# Altium schematic sheet Control_Logic.SchDoc
size A3; SheetNumber: 9; SheetTotal: 9
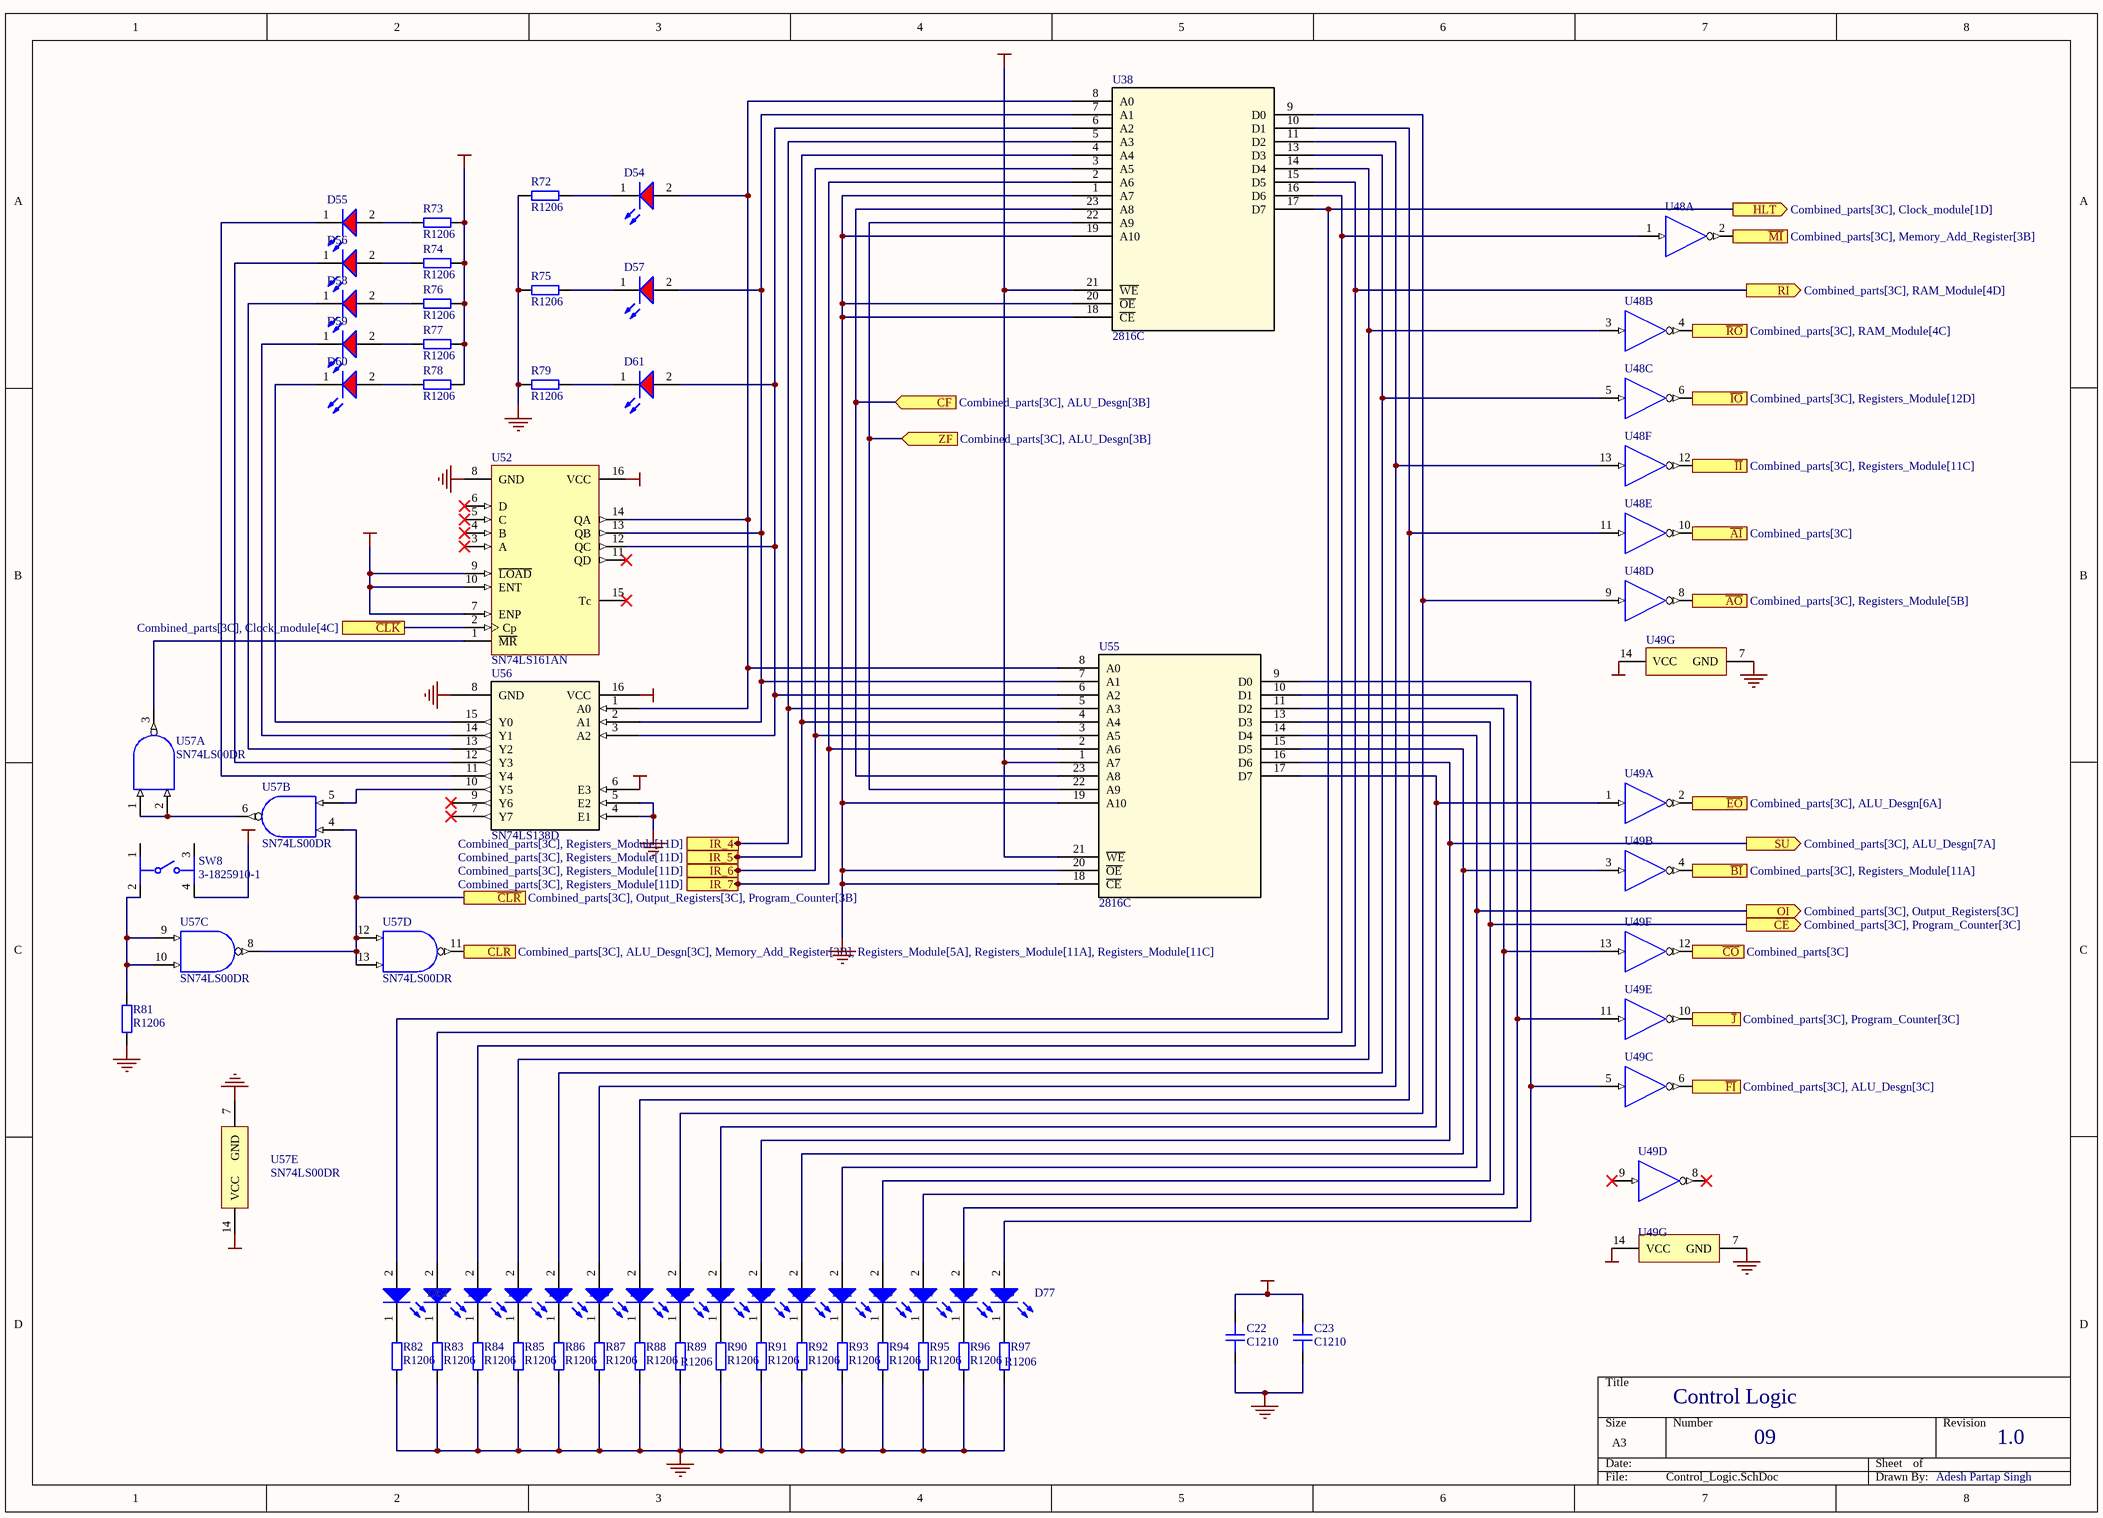
[diagram p0: Control_Logic.SchDoc]

## Parts
(Parts that share a designator on the sheet are numbered #1, #2 ... from top to bottom, then left to right.)
C22  C1210  [CAP_1210]
C23  C1210  [CAP_1210]
D54  151053RS03000  [WL-TMRW_D5.8H11.7]  (value not drawn)
D55  151053RS03000  [WL-TMRW_D5.8H11.7]  (value not drawn)
D56  151053RS03000  [WL-TMRW_D5.8H11.7]  (value not drawn)
D57  151053RS03000  [WL-TMRW_D5.8H11.7]  (value not drawn)
D58  151053RS03000  [WL-TMRW_D5.8H11.7]  (value not drawn)
D59  151053RS03000  [WL-TMRW_D5.8H11.7]  (value not drawn)
D60  151053RS03000  [WL-TMRW_D5.8H11.7]  (value not drawn)
D61  151053RS03000  [WL-TMRW_D5.8H11.7]  (value not drawn)
D62  151053BS04500  [WL-TMRW_D5.8H11.7]  (value not drawn)
D63  151053BS04500  [WL-TMRW_D5.8H11.7]  (value not drawn)
D64  151053BS04500  [WL-TMRW_D5.8H11.7]  (value not drawn)
D65  151053BS04500  [WL-TMRW_D5.8H11.7]  (value not drawn)
D66  151053BS04500  [WL-TMRW_D5.8H11.7]  (value not drawn)
D67  151053BS04500  [WL-TMRW_D5.8H11.7]  (value not drawn)
D68  151053BS04500  [WL-TMRW_D5.8H11.7]  (value not drawn)
D69  151053BS04500  [WL-TMRW_D5.8H11.7]  (value not drawn)
D70  151053BS04500  [WL-TMRW_D5.8H11.7]  (value not drawn)
D71  151053BS04500  [WL-TMRW_D5.8H11.7]  (value not drawn)
D72  151053BS04500  [WL-TMRW_D5.8H11.7]  (value not drawn)
D73  151053BS04500  [WL-TMRW_D5.8H11.7]  (value not drawn)
D74  151053BS04500  [WL-TMRW_D5.8H11.7]  (value not drawn)
D75  151053BS04500  [WL-TMRW_D5.8H11.7]  (value not drawn)
D76  151053BS04500  [WL-TMRW_D5.8H11.7]  (value not drawn)
D77  151053BS04500  [WL-TMRW_D5.8H11.7]  (value not drawn)
R72  R1206  [RES_1206]
R73  R1206  [RES_1206]
R74  R1206  [RES_1206]
R75  R1206  [RES_1206]
R76  R1206  [RES_1206]
R77  R1206  [RES_1206]
R78  R1206  [RES_1206]
R79  R1206  [RES_1206]
R81  R1206  [RES_1206]
R82  R1206  [RES_1206]
R83  R1206  [RES_1206]
R84  R1206  [RES_1206]
R85  R1206  [RES_1206]
R86  R1206  [RES_1206]
R87  R1206  [RES_1206]
R88  R1206  [RES_1206]
R89  R1206  [RES_1206]
R90  R1206  [RES_1206]
R91  R1206  [RES_1206]
R92  R1206  [RES_1206]
R93  R1206  [RES_1206]
R94  R1206  [RES_1206]
R95  R1206  [RES_1206]
R96  R1206  [RES_1206]
R97  R1206  [RES_1206]
SW8  3-1825910-1  [FP-3-1825910-1-MFG]
U38  2816C  [28P6_ATM]
U48  SN74LS04NSR  [NS0014A_M]  (value not drawn)  (parts A,B,C,D,E,F of 7)
U49#1  SN74LS04NSR  [NS0014A_M]  (value not drawn)  (parts A,B,C,D,E,F,G of 7)
U49#2  SN74LS04NSR  [NS0014A_M]  (value not drawn)  (part G of 7)
U52  SN74LS161AN  [N0016A]
U55  2816C  [28P6_ATM]
U56  SN74LS138D  [D16]
U57  SN74LS00DR  [D0014A_L]  (parts A,B,C,D,E of 5)

## Ports
CE (out, see Combined_parts[3C], Program_Counter[3C]), CF (in, see Combined_parts[3C], ALU_Desgn[3B]), CLR (see Combined_parts[3C], ALU_Desgn[3C], Memory_Add_Register[3B], Registers_Module[5A], Registers_Module[11A], Registers_Module[11C]), HLT (out, see Combined_parts[3C], Clock_module[1D]), IR_4 (in, see Combined_parts[3C], Registers_Module[11D]), IR_5 (in, see Combined_parts[3C], Registers_Module[11D]), IR_6 (in, see Combined_parts[3C], Registers_Module[11D]), IR_7 (in, see Combined_parts[3C], Registers_Module[11D]), OI (out, see Combined_parts[3C], Output_Registers[3C]), RI (out, see Combined_parts[3C], RAM_Module[4D]), SU (out, see Combined_parts[3C], ALU_Desgn[7A]), ZF (in, see Combined_parts[3C], ALU_Desgn[3B]), ~{AI} (out, see Combined_parts[3C]), ~{AO} (out, see Combined_parts[3C], Registers_Module[5B]), ~{BI} (out, see Combined_parts[3C], Registers_Module[11A]), ~{CLK} (see Combined_parts[3C], Clock_module[4C]), ~{CLR} (see Combined_parts[3C], Output_Registers[3C], Program_Counter[3B]), ~{CO} (out, see Combined_parts[3C]), ~{EO} (out, see Combined_parts[3C], ALU_Desgn[6A]), ~{FI} (out, see Combined_parts[3C], ALU_Desgn[3C]), ~{II} (out, see Combined_parts[3C], Registers_Module[11C]), ~{IO} (out, see Combined_parts[3C], Registers_Module[12D]), ~{J} (out, see Combined_parts[3C], Program_Counter[3C]), ~{MI} (out, see Combined_parts[3C], Memory_Add_Register[3B]), ~{RO} (out, see Combined_parts[3C], RAM_Module[4C])

## Nets
GND: C22.1 C23.1 R72.1 R75.1 R79.1 R81.1 R82.1 R83.1 R84.1 R85.1 R86.1 R87.1 R88.1 R89.1 R90.1 R91.1 R92.1 R93.1 R94.1 R95.1 R96.1 R97.1 U38.1(A7) U38.18(~{CE}) U38.19(A10) U38.20(~{OE}) U49#1.7(GND) U49#2.7(GND) U52.8(GND) U55.18(~{CE}) U55.19(A10) U55.20(~{OE}) U56.4(E1) U56.5(E2) U56.8(GND) U57.7(GND)
VCC: C22.2 C23.2 R73.2 R74.2 R76.2 R77.2 R78.2 SW8.4 U38.21(~{WE}) U49#1.14(VCC) U49#2.14(VCC) U52.7(ENP) U52.9(~{LOAD}) U52.10(ENT) U52.16(VCC) U55.1(A7) U55.21(~{WE}) U56.6(E3) U56.16(VCC) U57.14(VCC)
~{AI}: U48.10(~{5Y}) ; port ~{AI}
~{AO}: U48.8(~{4Y}) ; port ~{AO}
~{BI}: U49#1.4(~{2Y}) ; port ~{BI}
~{CLK}: U52.2(Cp) ; port ~{CLK}
~{CLR}: U57.4(2A) U57.8(3Y) U57.12(4A) U57.13(4B) ; port ~{CLR}
~{CO}: U49#1.12(~{6Y}) ; port ~{CO}
CE: D74.2(A) U55.13(D3) ; port CE
CF: U38.23(A8) U55.23(A8) ; port CF
CLR: U57.11(4Y) ; port CLR
~{EO}: U49#1.2(~{1Y}) ; port ~{EO}
~{FI}: U49#1.6(~{3Y}) ; port ~{FI}
HLT: D62.2(A) U38.17(D7) ; port HLT
~{II}: U48.12(~{6Y}) ; port ~{II}
~{IO}: U48.6(~{3Y}) ; port ~{IO}
IR_4: U38.5(A3) U55.5(A3) ; port IR_4
IR_5: U38.4(A4) U55.4(A4) ; port IR_5
IR_6: U38.3(A5) U55.3(A5) ; port IR_6
IR_7: U38.2(A6) U55.2(A6) ; port IR_7
~{J}: U49#1.10(~{5Y}) ; port ~{J}
~{MI}: U48.2(~{1Y}) ; port ~{MI}
OI: D73.2(A) U55.14(D4) ; port OI
~{RO}: U48.4(~{2Y}) ; port ~{RO}
RI: D64.2(A) U38.15(D5) ; port RI
SU: D71.2(A) U55.16(D6) ; port SU
ZF: U38.22(A9) U55.22(A9) ; port ZF
NetD54_1: D54.1(K) R72.2
NetD54_2: D54.2(A) U38.8(A0) U52.14(QA) U55.8(A0) U56.1(A0)
NetD55_1: D55.1(K) U56.11(Y4)
NetD55_2: D55.2(A) R73.1
NetD56_1: D56.1(K) U56.12(Y3)
NetD56_2: D56.2(A) R74.1
NetD57_1: D57.1(K) R75.2
NetD57_2: D57.2(A) U38.7(A1) U52.13(QB) U55.7(A1) U56.2(A1)
NetD58_1: D58.1(K) U56.13(Y2)
NetD58_2: D58.2(A) R76.1
NetD59_1: D59.1(K) U56.14(Y1)
NetD59_2: D59.2(A) R77.1
NetD60_1: D60.1(K) U56.15(Y0)
NetD60_2: D60.2(A) R78.1
NetD61_1: D61.1(K) R79.2
NetD61_2: D61.2(A) U38.6(A2) U52.12(QC) U55.6(A2) U56.3(A2)
NetD62_1: D62.1(K) R82.2
NetD63_1: D63.1(K) R83.2
NetD63_2: D63.2(A) U38.16(D6) U48.1(1A)
NetD64_1: D64.1(K) R84.2
NetD65_1: D65.1(K) R85.2
NetD65_2: D65.2(A) U38.14(D4) U48.3(2A)
NetD66_1: D66.1(K) R86.2
NetD66_2: D66.2(A) U38.13(D3) U48.5(3A)
NetD67_1: D67.1(K) R87.2
NetD67_2: D67.2(A) U38.11(D2) U48.13(6A)
NetD68_1: D68.1(K) R88.2
NetD68_2: D68.2(A) U38.10(D1) U48.11(5A)
NetD69_1: D69.1(K) R89.2
NetD69_2: D69.2(A) U38.9(D0) U48.9(4A)
NetD70_1: D70.1(K) R90.2
NetD70_2: D70.2(A) U49#1.1(1A) U55.17(D7)
NetD71_1: D71.1(K) R91.2
NetD72_1: D72.1(K) R92.2
NetD72_2: D72.2(A) U49#1.3(2A) U55.15(D5)
NetD73_1: D73.1(K) R93.2
NetD74_1: D74.1(K) R94.2
NetD75_1: D75.1(K) R95.2
NetD75_2: D75.2(A) U49#1.13(6A) U55.11(D2)
NetD76_1: D76.1(K) R96.2
NetD76_2: D76.2(A) U49#1.11(5A) U55.10(D1)
NetD77_1: D77.1(K) R97.2
NetD77_2: D77.2(A) U49#1.5(3A) U55.9(D0)
NetR81_2: R81.2 SW8.2 U57.9(3A) U57.10(3B)
NetU52_1: U52.1(~{MR}) U57.3(1Y)
NetU56_10: U56.10(Y5) U57.5(2B)
NetU57_1: U57.1(1A) U57.2(1B) U57.6(2Y)

Not connected (* = marked no-connect by the designer): SW8 1 3; U49#1 8(~{4Y})* 9(4A)*; U52 3(A)* 4(B)* 5(C)* 6(D)* 11(QD)* 15(Tc)*; U56 7(Y7)* 9(Y6)*

## Notes on the sheet
- Control Logic
- 09
- 1.0
- Adesh Partap Singh

## Library data of the parts
C22 C23 = CAP_1210: Capacitor SMD 1210; Manufacturer: *; Manufacturer Part Number: *; Distributor Link: *; LCSC: *; Rating: *; Dielectric: *
D54-D61 = CMP-1489-00007-2: NexarPartId: 29717818; Viewing Angle: 30°; Test Current: 20mA; Forward Voltage: 1.9V; Lens Size: 5mm; Wavelength: 623nm; Lens Style: Circular, Clear, Round; Luminous Intensity: 5cd; Peak Wavelength: 631nm; Max Reverse Voltage (DC): 5V; Forward Current: 100mA; Color: Red; Height: 8.6mm; Packaging: Bulk; Length: 5mm; Dominant Wavelength: 623nm; RoHS: Compliant; Mount: Through Hole; Max Operating Temperature: 85°C; Width: 5mm; Case/Package: Radial; Min Operating Temperature: -40°C; REACH SVHC: Unknown
D62-D77 = BLUE-LED-5mm: NexarPartId: 29717816; Peak Wavelength: 461nm; Luminous Intensity: 2cd; Dominant Wavelength: 465nm; Test Current: 20mA; Lens Style: Circular, Clear, Round; Forward Voltage: 2.7V; Forward Current: 100mA; Viewing Angle: 45°; Lens Size: 5mm; Color: Blue; Max Reverse Voltage (DC): 5V; Max Operating Temperature: 85°C; Wavelength: 465nm; REACH SVHC: Unknown; Height: 8.6mm; Min Operating Temperature: -40°C; Width: 5mm; RoHS: Compliant; Mount: Through Hole; Length: 5mm; Case/Package: Radial; Packaging: Bulk
R72-R79 R81-R97 = RES_1206: Resistor SMD 1206; Manufacturer: *; Manufacturer Part Number: *; Distributor Link: *; LCSC: *
SW8 = CMP-03407-000001-1: SWITCH TACTILE SPST-NO 0.05A 24V; Manufacturer: TE Connectivity; Operating Force: 160gf; Contact Current Rating: 50mA; Contact Resistance: 100mΩ; Electromechanical Life: 100000Cycles; Device Class L1: Electromechanical; ComponentLink2URL: https://www.te.com/commerce/DocumentDelivery/DDEController?Action=srchrtrv&DocNm=1825910&DocType=Customer+Drawing&DocLang=English; Category: Switch; Device Class L2: Switches; Temperature: -35°C to +85°C; RoHS: TRUE; Mount: Through Hole; Manufacturer Part Number: 3-1825910-1; Automotive: No; Lead Free: Yes; Device Class L3: Tactile Switches; ComponentLink2Description: Datasheet; Temperature Range High: +85°C; Height: 17.3mm; Package: 0; Temperature Range Low: -35°C; Throw Configuration: SPST-NO; Digikey Description: SWITCH TACTILE SPST-NO 0.05A 24V; Octopart: https://octopart.com/3-1825910-1-te+connectivity-46506874
U38 U55 = 2816C: EEPROM Memory IC 64Kbit Parallel 150 ns 28-PDIP; Mfr_Name: Texas Instruments; Manufacturer_Part_Number: SN74LS273DWR; Copyright: Copyright (C) 2023 Ultra Librarian. All rights reserved.; RefDes: RefDes; Type: DEV
U48 U49#1 U49#2 = CMP-1615-00958-3: Hex inverters, NS0014A, LARGE T&R; Manufacturer: Texas Instruments; VCC(Min)(V): 4.75; ICC @ Nom Voltage(Max)(mA): 0.033; tpd @ Nom Voltage(Max)(ns): 22; Rating: Catalog; F @ Nom Voltage(Max)(Mhz): 35; Voltage(Nom)(V): 5; VCC(Max)(V): 5.25; Output Drive (IOL/IOH)(Max)(mA): -0.4/8; Output Type: CMOS; Schmitt Trigger: No; Input Type: TTL; Technology Family: LS; Bits(#): 6; Operating Temperature Range(C): 0 to 70; DatasheetVersion: SDLS029C; Generic Part Number: SN74LS04; PackageReference: NS0014A
U52 = IC_BINARY_COUNTER-4-BIT_16DIP: Synchronous 4-Bit Binary Counters, N0016A, TUBE; Manufacturer: Texas Instruments; VCC(Max)(V): 5.25; tpd @ Nom Voltage(Max)(ns): 35; Output Type: CMOS; Input Type: TTL; ICC @ Nom Voltage(Max)(mA): 32; VCC(Min)(V): 4.75; Technology Family: LS; Voltage(Nom)(V): 5; Output Drive (IOL/IOH)(Max)(mA): 8/-0.4; Inputs: 1; Schmitt Trigger: No; Rating: Catalog; Bits(#): 4; Type: Binary; Generic Part Number: SN74LS161A; Code_JEDEC: MS-001; F @ Nom Voltage(Max)(Mhz): 35; Function: Counter; PackageReference: N0016A; DatasheetVersion: SDLS060; Operating Temperature Range(C): 0 to 70
U56 = SN74LS138D: No Description Available; Mfr_Name: Texas Instruments; Copyright: Copyright (C) 2023 Ultra Librarian. All rights reserved.; Manufacturer_Part_Number: SN74LS138D; RefDes: RefDes; Type: DEV
U57 = NAND_GATE: Quad 2-input positive-NAND gates, D0014A, LARGE T&R; Manufacturer: Texas Instruments; Bits(#): 4; tpd @ Nom Voltage(Max)(ns): 22; VCC(Max)(V): 5.25; F @ Nom Voltage(Max)(Mhz): 35; VCC(Min)(V): 4.75; Input Type: TTL; Output Drive (IOL/IOH)(Max)(mA): 0.4/-16; ICC @ Nom Voltage(Max)(mA): 0.022; Voltage(Nom)(V): 5; Rating: Catalog; Technology Family: LS; Schmitt Trigger: No; Operating Temperature Range(C): 0 to 70; Code_JEDEC: MS-012; PackageReference: D0014A; Output Type: TTL; Generic Part Number: SN74LS00; DatasheetVersion: SDLS025B